# EAGLE design Voice Interaction Hat for raspberry pi v1.1 (EAGLE 6.1)
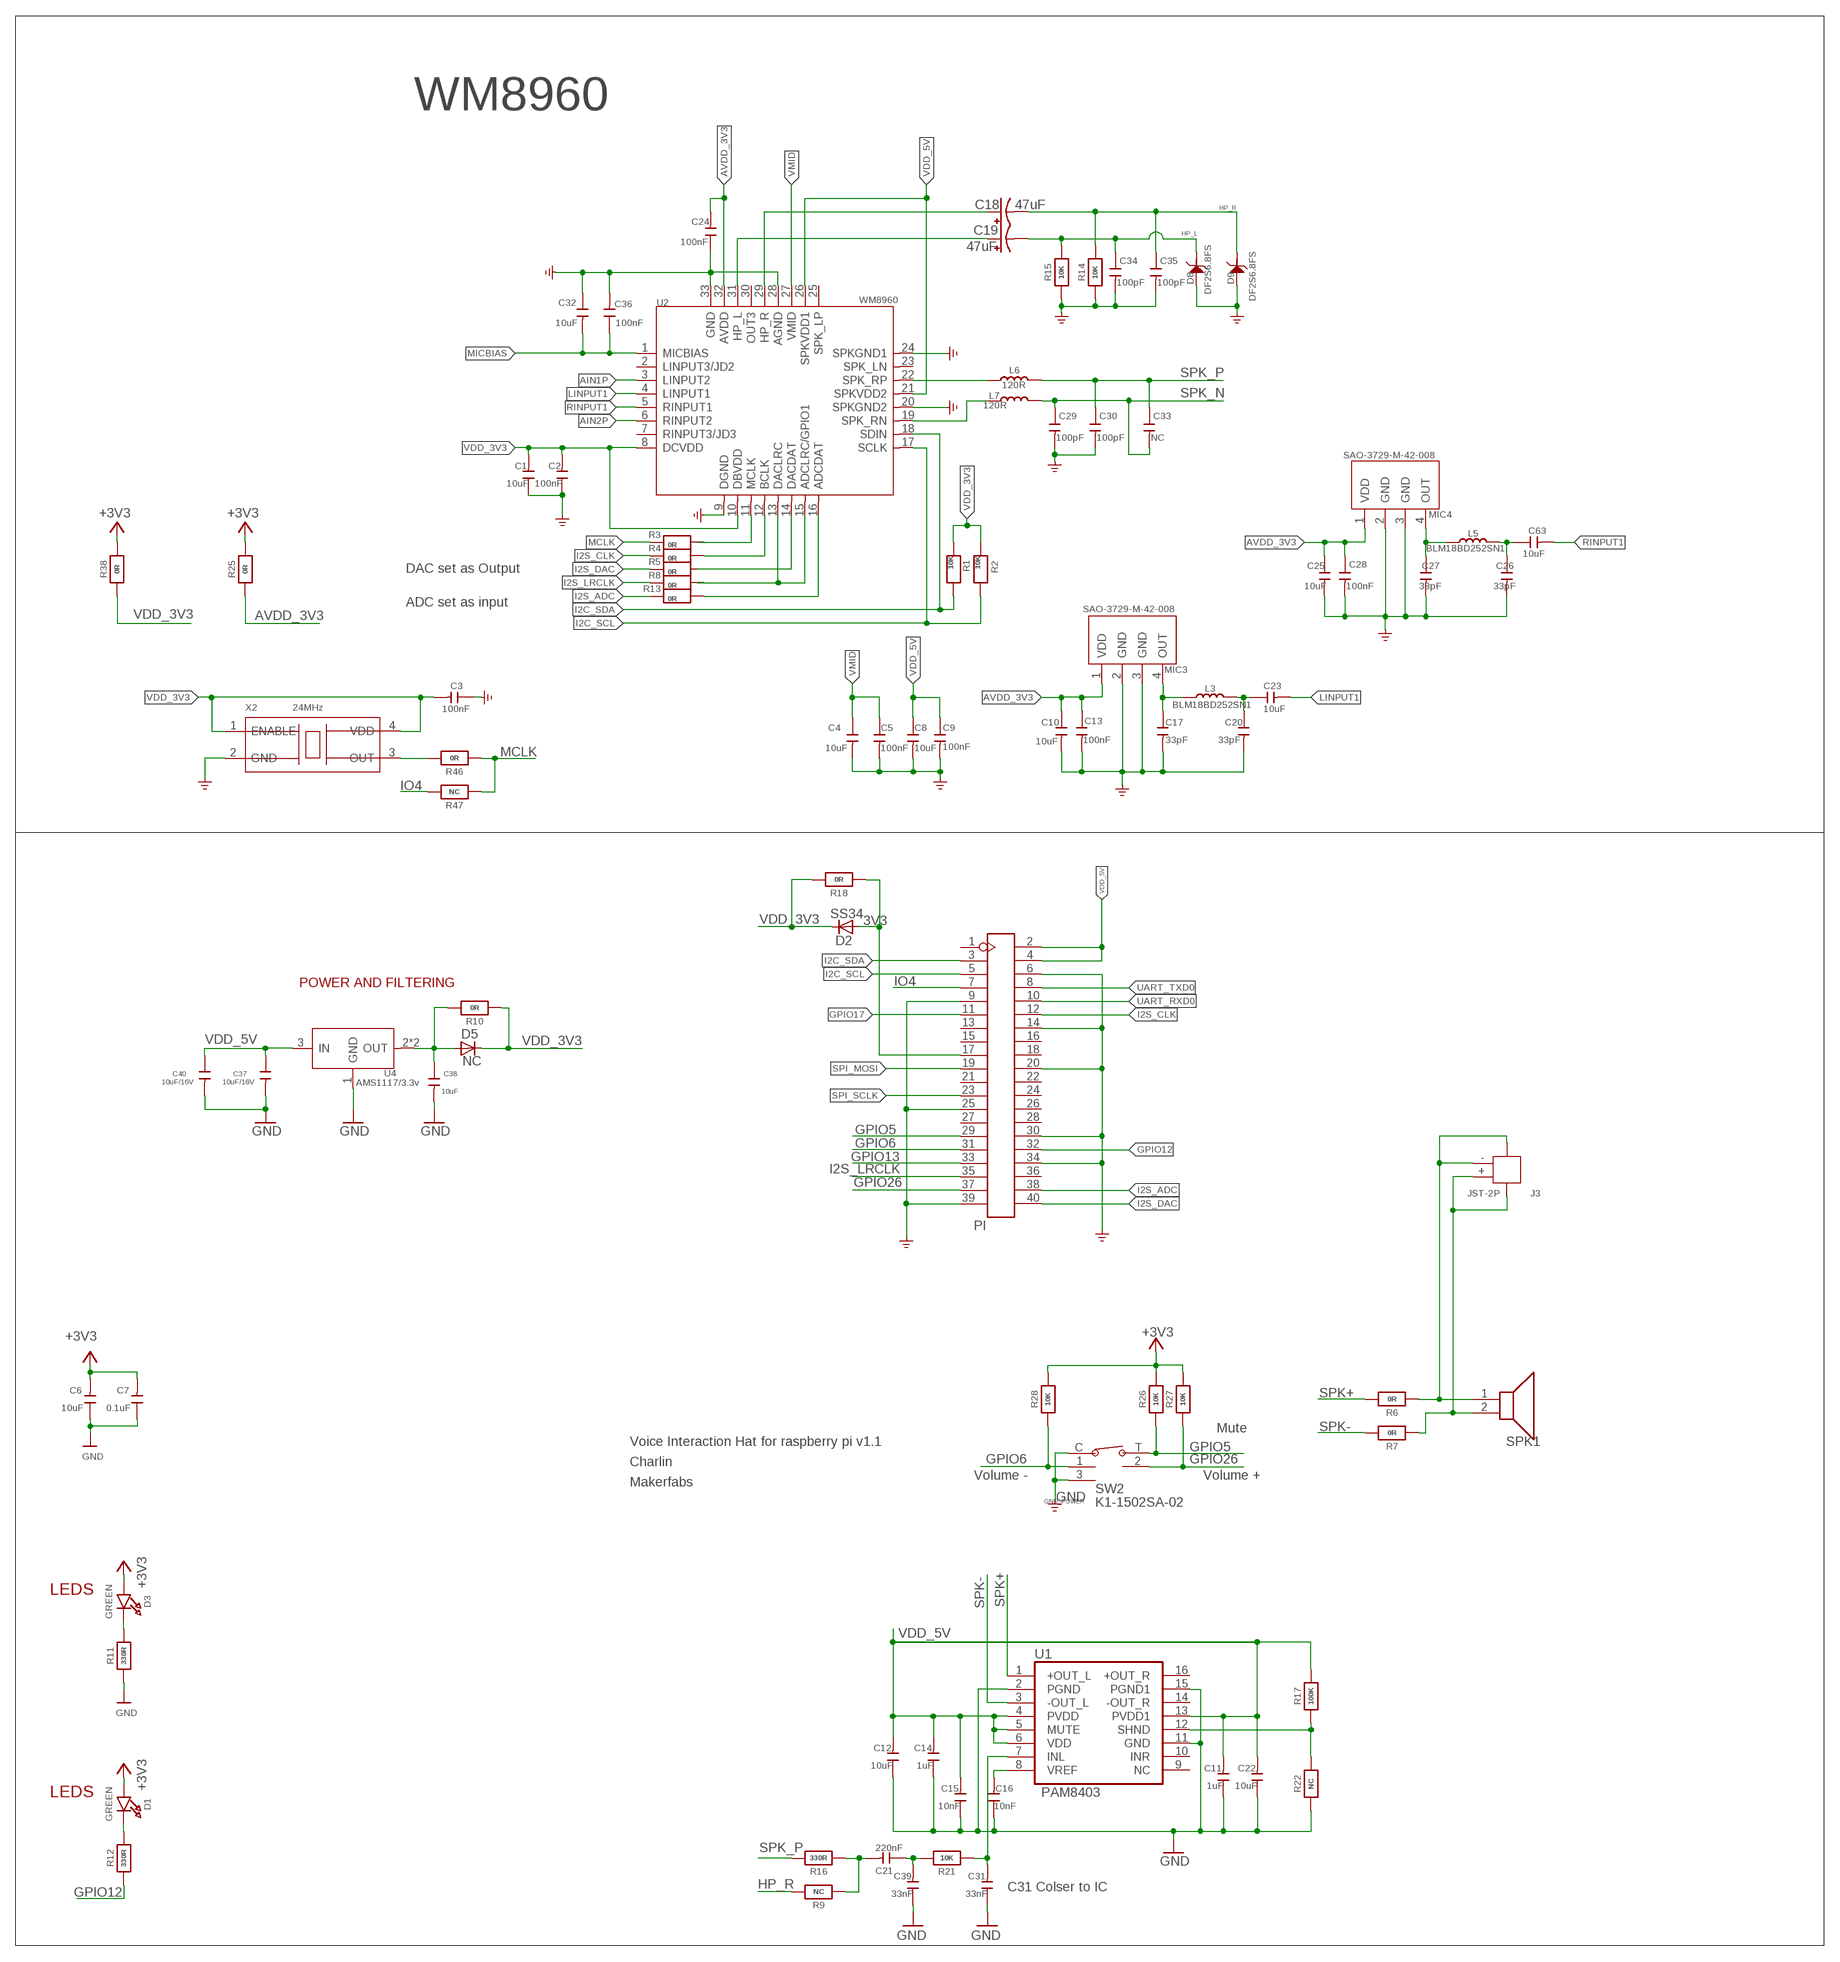
[diagram p0: schematic, sheet 1]

## Parts
C1  10uF  DISCRETE_C-0603  [DISCRETE_C0603]
C2  100nF  DISCRETE_C-0603  [DISCRETE_C0603]
C3  100nF  DISCRETE_C-0603  [DISCRETE_C0603]
C4  10uF  CAP-0603  [C0603]
C5  100nF  CAP-0603  [C0603]
C6  10uF  DISCRETE_C-0603  [DISCRETE_C0603]
C7  0.1uF  DISCRETE_C-0603  [DISCRETE_C0603]
C8  10uF  CAP-0603  [C0603]
C9  100nF  CAP-0603  [C0603]
C10  10uF  CAP-0603  [C0603]
C11  1uF  DISCRETE_C-0603  [DISCRETE_C0603]
C12  10uF  DISCRETE_C-0603  [DISCRETE_C0603]
C13  100nF  CAP-0603  [C0603]
C14  1uF  DISCRETE_C-0603  [DISCRETE_C0603]
C15  10nF  DISCRETE_C-0603  [DISCRETE_C0603]
C16  10nF  DISCRETE_C-0603  [DISCRETE_C0603]
C17  33pF  CAP-0603  [C0603]
C18  47uF  47UF-POLAR-EIA3528-10V-10%  [EIA3528]
C19  47uF  47UF-POLAR-EIA3528-10V-10%  [EIA3528]
C20  33pF  CAP-0603  [C0603]
C21  220nF  DISCRETE_C-0603  [DISCRETE_C0603]
C22  10uF  DISCRETE_C-0603  [DISCRETE_C0603]
C23  10uF  CAP-0603  [C0603]
C24  100nF  DISCRETE_C-0603  [DISCRETE_C0603]
C25  10uF  CAP-0603  [C0603]
C26  33pF  CAP-0603  [C0603]
C27  33pF  CAP-0603  [C0603]
C28  100nF  CAP-0603  [C0603]
C29  100pF  CAP-0603  [C0603]
C30  100pF  CAP-0603  [C0603]
C31  33nF  DISCRETE_C-0603  [DISCRETE_C0603]
C32  10uF  CAP-0603  [C0603]
C33  NC  CAP-0603  [C0603]
C34  100pF  CAP-0603  [C0603]
C35  100pF  CAP-0603  [C0603]
C36  100nF  DISCRETE_C-0603  [DISCRETE_C0603]
C37  10uF/16V  C-0603  [0603]
C38  10uF  C-0603  [0603]
C39  33nF  DISCRETE_C-0603  [DISCRETE_C0603]
C40  10uF/16V  C-0603  [0603]
C63  10uF  CAP-0603  [C0603]
D1  GREEN  LED0805_NOOUTLINE  [CHIPLED_0805_NOOUTLINE]
D2  SS34  DIODE-DO-214AC  [DO-214AC]
D3  GREEN  LED0805_NOOUTLINE  [CHIPLED_0805_NOOUTLINE]
D5  NC  DIODE-DO-214AC  [DO-214AC]
D8  DF2S6.8FS  D-ESD-2P'DF2S6.8FS'  [SOD-923]
D9  DF2S6.8FS  D-ESD-2P'DF2S6.8FS'  [SOD-923]
J3  JST-2P  JST-2P-SMD'2.0'  [HW2-SMD-2.0-90D]
L3  BLM18BD252SN1  INDUCTOR/FERRITE-BEAD'0603'  [L0603]
L5  BLM18BD252SN1  INDUCTOR/FERRITE-BEAD'0603'  [L0603]
L6  120R  INDUCTOR/FERRITE-BEAD'0603'  [L0603]
L7  120R  INDUCTOR/FERRITE-BEAD'0603'  [L0603]
MIC3  SAO-3729-M-42-008  MIC-MSM421A3729H8-C  [MIC4-SMD-3.76X2.95MM]
MIC4  SAO-3729-M-42-008  MIC-MSM421A3729H8-C  [MIC4-SMD-3.76X2.95MM]
PI  HEADER-2X20P1  [DIP-2X20-2.54MM]
R1  10K  RESISTOR_0603_NOOUT  [0603-NO]
R2  10K  RESISTOR_0603_NOOUT  [0603-NO]
R3  0R  RESISTOR_0603_NOOUT  [0603-NO]
R4  0R  RESISTOR_0603_NOOUT  [0603-NO]
R5  0R  RESISTOR_0603_NOOUT  [0603-NO]
R6  0R  RESISTOR_0603_NOOUT  [0603-NO]
R7  0R  RESISTOR_0603_NOOUT  [0603-NO]
R8  0R  RESISTOR_0603_NOOUT  [0603-NO]
R9  NC  RESISTOR_0603_NOOUT  [0603-NO]
R10  0R  RESISTOR_0603_NOOUT  [0603-NO]
R11  330R  RESISTOR_0603_NOOUT  [0603-NO]
R12  330R  RESISTOR_0603_NOOUT  [0603-NO]
R13  0R  RESISTOR_0603_NOOUT  [0603-NO]
R14  10K  RESISTOR_0603_NOOUT  [0603-NO]
R15  10K  RESISTOR_0603_NOOUT  [0603-NO]
R16  330R  RESISTOR_0603_NOOUT  [0603-NO]
R17  100K  RESISTOR_0603_NOOUT  [0603-NO]
R18  0R  RESISTOR_0603_NOOUT  [0603-NO]
R21  10K  RESISTOR_0603_NOOUT  [0603-NO]
R22  NC  RESISTOR_0603_NOOUT  [0603-NO]
R25  0R  RESISTOR_0603_NOOUT  [0603-NO]
R26  10K  RESISTOR_0603_NOOUT  [0603-NO]
R27  10K  RESISTOR_0603_NOOUT  [0603-NO]
R28  10K  RESISTOR_0603_NOOUT  [0603-NO]
R38  0R  RESISTOR_0603_NOOUT  [0603-NO]
R46  0R  RESISTOR_0603_NOOUT  [0603-NO]
R47  NC  RESISTOR_0603_NOOUT  [0603-NO]
SPK1  SPK  [SPK-SMD2-5000L3000W]
SW2  K1-1502SA-02  [SMD5-60P-1180L1170W]
U1  PAM8403  [SOP-16]
U2  WM8960  AMPLIFIER-WM8960  [QFN32G-0.5-5X5MM]
U4  AMS1117/3.3v  LD1117'SOT89'  [SOT89]
X2  24MHz  CRYSTAL-OSCILLATOR2.5*2.0  [OSC4-SMD-2.5X2.0X0.8MM]

## Nets
3V3: D2.A PI.17 R18.1
$123: C18.A(+) U2.29(HP_R)
$124: C19.A(+) U2.31(HP_L)
+3V3: C6.2 C7.2 D1.A D3.A R25.2 R26.2 R27.2 R28.2 R38.2
AIN1P: U2.3(LINPUT2)
AIN2P: U2.6(RINPUT2)
AUDIO_SHDN: R17.1 R22.2 U1.12(SHND)
AVDD_3V3: C10.1 C13.1 C24.2 C25.1 C28.1 MIC3.1(VDD) MIC4.1(VDD) R25.1 U2.32(AVDD)
GND: C1.1 C2.1 C3.1 C4.2 C5.2 C6.1 C7.1 C8.2 C9.2 C10.2 C11.1 C12.1 C13.2 C14.1 C15.1 C16.1 C17.2 C20.2 C22.1 C24.1 C25.2 C26.2 C27.2 C28.2 C29.2 C30.2 C31.1 C32.1 C34.2 C35.2 C36.2 C37.2 C38.2 C39.1 C40.2 D8.2 D9.2 MIC3.2(GND) MIC3.3(GND) MIC4.2(GND) MIC4.3(GND) PI.6 PI.9 PI.14 PI.20 PI.25 PI.30 PI.34 PI.39 R11.1 R14.1 R15.1 R22.1 SW2.3 SW2.C U1.2(PGND) U1.11(GND) U1.15(PGND1) U2.9(DGND) U2.20(SPKGND2) U2.24(SPKGND1) U2.28(AGND) U2.33(GND) U4.1(GND) X2.2(GND) ; supply symbol labelled GND_POWER
GPIO5: PI.29 R26.1 SW2.T
GPIO6: PI.31 R28.1 SW2.1
GPIO12: PI.32 R12.1
GPIO13: PI.33
GPIO17: PI.11
GPIO26: PI.37 R27.1 SW2.2
HP_L: C19.C(-) C34.1 D8.1 R15.2
HP_R: C18.C(-) C35.1 D9.1 R9.2 R14.2
I2C_SCL: PI.5 R2.1 U2.17(SCLK)
I2C_SDA: PI.3 R1.1 U2.18(SDIN)
I2S_ADC: PI.38 R13.2
I2S_CLK: PI.12 R4.2
I2S_DAC: PI.40 R5.2
I2S_LRCLK: PI.35 R8.2
IO4: PI.7 R47.2
LINPUT1: C23.2 U2.4(LINPUT1)
MCLK: R3.2 R46.1 R47.1
MICBIAS: C32.2 C36.1 U2.1(MICBIAS)
N$1: C38.1 D5.A R10.2 U4.2(OUT) U4.4(OUT)
N$3: D1.C R12.2
N$4: C31.2 R21.1 U1.7(INL)
N$5: D3.C R11.2
N$6: J3.3 J3.- R6.1 SPK1.1
N$7: C21.1 C39.2 R21.2
N$9: J3.4 J3.+ R7.1 SPK1.2
N$10: R5.1 U2.14(DACDAT)
N$12: C20.1 C23.1 L3.2
N$13: C17.1 L3.1 MIC3.4(OUT)
N$15: C26.1 C63.1 L5.2
N$16: C16.2 U1.8(VREF)
N$17: R46.2 X2.3(OUT)
N$30: C27.1 L5.1 MIC4.4(OUT)
N$34: R13.1 U2.16(ADCDAT)
N$35: R8.1 U2.13(DACLRC) U2.15(ADCLRC/GPIO1)
N$36: R4.1 U2.12(BCLK)
N$37: R3.1 U2.11(MCLK)
N$42: L6.1 U2.22(SPK_RP)
N$45: L7.1 U2.19(SPK_RN)
N$62: C21.2 R9.1 R16.1
RINPUT1: C63.2 U2.5(RINPUT1)
SPI_MOSI: PI.19
SPI_SCLK: PI.23
SPK+ [3V3]: R6.2 U1.1(+OUT_L)
SPK- [3V3]: R7.2 U1.3(-OUT_L)
SPK_N: C29.1 C33.2 L7.2
SPK_P: C30.1 C33.1 L6.2 R16.2
UART_RXD0: PI.10
UART_TXD0: PI.8
VDD_3V3: C1.2 C2.2 C3.2 D2.C D5.C R1.2 R2.2 R10.1 R18.2 R38.1 U2.8(DCVDD) U2.10(DBVDD) X2.1(ENABLE) X2.4(VDD)
VDD_5V: C8.1 C9.1 C11.2 C12.2 C14.2 C15.2 C22.2 C37.1 C40.1 PI.2 PI.4 R17.2 U1.4(PVDD) U1.5(MUTE) U1.6(VDD) U1.13(PVDD1) U2.21(SPKVDD2) U2.26(SPKVDD1) U4.3(IN)
VMID: C4.1 C5.1 U2.27(VMID)
Unconnected: PI.1 PI.13 PI.15 PI.16 PI.18 PI.21 PI.22 PI.24 PI.26 PI.27 PI.28 PI.36 U1.9(NC) U1.10(INR) U1.14(-OUT_R) U1.16(+OUT_R) U2.2(LINPUT3/JD2) U2.7(RINPUT3/JD3) U2.23(SPK_LN) U2.25(SPK_LP) U2.30(OUT3)

## Notes on the sheet
- WM8960
- DAC set as Output
- ADC set as input
- POWER AND FILTERING
- Mute
- Voice Interaction Hat for raspberry pi v1.1
- Charlin
- Volume - | Volume +
- Makerfabs
- LEDS
- LEDS
- C31 Colser to IC

## Library data of the parts
C1-C3 C6 C7 C11 C12 C14-C16 C21 C22 C24 C31 C36 C39 = A9G:DISCRETE_C*: Ceramic Capacitors
C4 C5 C8-C10 C13 C17 C20 C23 C25-C30 C32-C35 C63 = Discrete-new:CAP: Ceramic Capacitors
C18 C19 = SparkFun-Capacitors:47UF-POLAR: 47µF polarized capacitors A capacitor is a passive two-terminal electrical component used to store electrical energy temporarily in an electric field.; PROD_ID: CAP-08310
C37 C38 C40 = Discrete:C*: Ceramic Capacitors
D1 D3 = microbuilder:LED: LED 0603 - 0603 Surface Mount Package 2mA: Green LED - Low Power (3.9mcd, 2ma, 1.7Vf) - Digikey: 475-2709-2-ND Orange LED - Low Power (9.8mcd, 2ma, 1.8Vf) - Digikey: 475-1194-2-ND Red LED - Low Power (5mcd, 2ma, 1.8Vf) - Digikey: 475-1195-2-ND Yellow LED - Low Power (7mcd, 2ma, 1.8Vf) - Digikey: 475-1196-2-ND 5mA: Blue LED - Low Power (17mcd, 5ma, 2.9Vf) - Digikey: LNJ937W8CRACT-ND 0805 - 0805 Surface Mount Package 2mA: Red LED (8.8mcd, 2mA, 1.8Vf, Clear) - Low Power [Digikey: 475-2510-1-ND] Green LED (5mcd, 2mA, 1.8Vf, Clear) - Low Power [Digikey: 475-2730-1-ND] Yellow LED (11.3mcd, 2mA, 1.8Vf, Clear) - Low Power [Digikey: 475-2555-1-ND] 20mA: Red LED (104mcd, 20mA, Diffused) - LS R976 [Digikey: 475-1278-6-ND] Red LED (12mcd, 20mA, 2.0Vf, Clear) - APT2012EC [Digikey: 754-1128-1-ND] Green LED (15mcd, 20mA, 2.2Vf, Clear) - APT2012GC [Digikey: 754-1131-1-ND] Orange LED (160mcd, 20mA, 2.1Vf, Clear) - APT2012SECK [Digikey: 754-1130-1-ND] 1206 - 1206 Surface Mount Package Green LED (26mcd, 20mA, Diffused) - LG N971 [Digikey: 475-1407-6-ND] Red LED (15mcd, 20mA, Diffused) - LH N974 [Digikey: 475-1416-6-ND] Cree - Cree High-Power Surface Mount LEDs XPEBWT-L1-0000-00D50 - White 111lm 350mA 2.9Vf 6200K 110° XTEAWT-00-0000-00000LEE3 - White 114lm 350mA 2.85Vf 5000K 115° Everlight - Everlight 45-21 Series Surface Mount LEDs 45-21/QK2C-B2832AC2CB2/2T - Warm White 2000mcd 20mA 3.25Vf 3050K 120° 45-21/LK2C-B38452C4CB2/2T - Nuetral White 2000mcd 20mA 3.25Vf 4150K 120° 45-21/LK2C-B50634C6CB2/2T - Cold White 2200mcd 20mA 3.25Vf 5650K 120° PLCC2 Reverse Mount LS T77K-J1L2-1-0-2-R18-Z - Red 11.25mcd 2mA 1.8Vf 630nm 120° LO T77K-L1M2-24-Z - Orange 19.6mcd 2mA 1.8Vf 606nm 120° LY T77K-K2M1-26-Z - Yellow 15.7mcd 2mA 1.8Vf 587nm 120°
D2 D5 = diode:DIODE-: DIODE
D8 D9 = Discrete-new:D-ESD-2P: SOD-923:304060009;SOD-123:304060001
J3 = Connector-new:JST-2P-SMD: 2P-SMD-1.0-90D:320110054;2P-SMD-2.0-90D:320110026
L3 L5-L7 = Discrete-new:INDUCTOR/FERRITE-BEAD
MIC3 MIC4 = Connector-new:MIC-MSM421A3729H8-C
PI = self:HEADER-2X20P
R1-R18 R21 R22 R25-R28 R38 R46 R47 = microbuilder:RESISTOR: Resistors For new designs, use the packages preceded by an '_' character since they are more reliable: The following footprints should be used on most boards: _0402 - Standard footprint for regular board layouts _0603 - Standard footprint for regular board layouts _0805 - Standard footprint for regular board layouts _1206 - Standard footprint for regular board layouts For extremely tight-pitch boards where space is at a premium, the following 'micro-pitch' footprints can be used (smaller pads, no silkscreen outline, etc.): _0402MP - Micro-pitch footprint for very dense/compact boards _0603MP - Micro-pitch footprint for very dense/compact boards _0805MP - Micro-pitch footprint for very dense/compact boards _1206MP - Micro-pitch footprint for very dense/compact boards
SPK1 = self:SPK
SW2 = self:K1-1502SA-02
U1 = PAM8403:PAM8403: Dual channel audio amplifier IC - PAM8403
U2 = IC-new:AMPLIFIER-WM8960
U4 = IC:LD1117: Low Drop Fixed And Adjustable Positive Voltage Regulators http://www.datasheetcatalog.org/datasheet/SGSThomsonMicroelectronics/mXuqtqv.pdf
X2 = Discrete-new:CRYSTAL-OSCILLATOR

## Net classes
0 default: width 0.203 mm, drill 0.305 mm, clearance 0.152 mm
2 3V3: width 0.305 mm
3 usbvcc: width 0.508 mm, drill 0.61 mm, clearance 0.254 mm

## Board
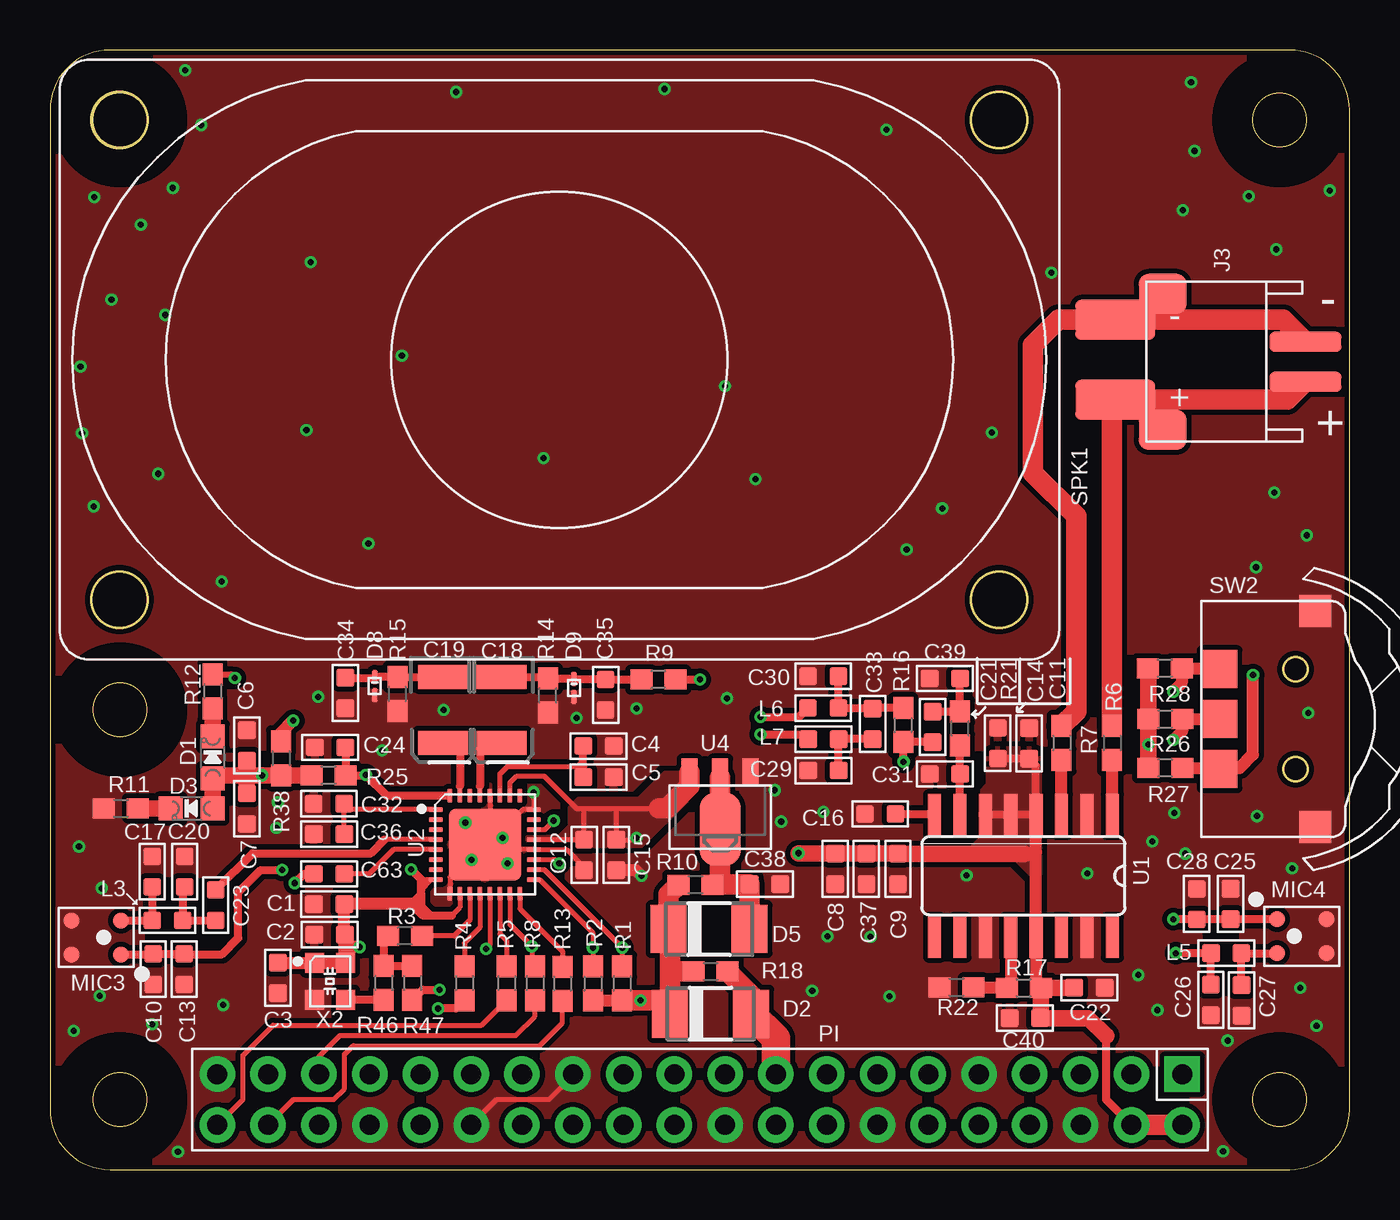
[diagram p1: board, top side]
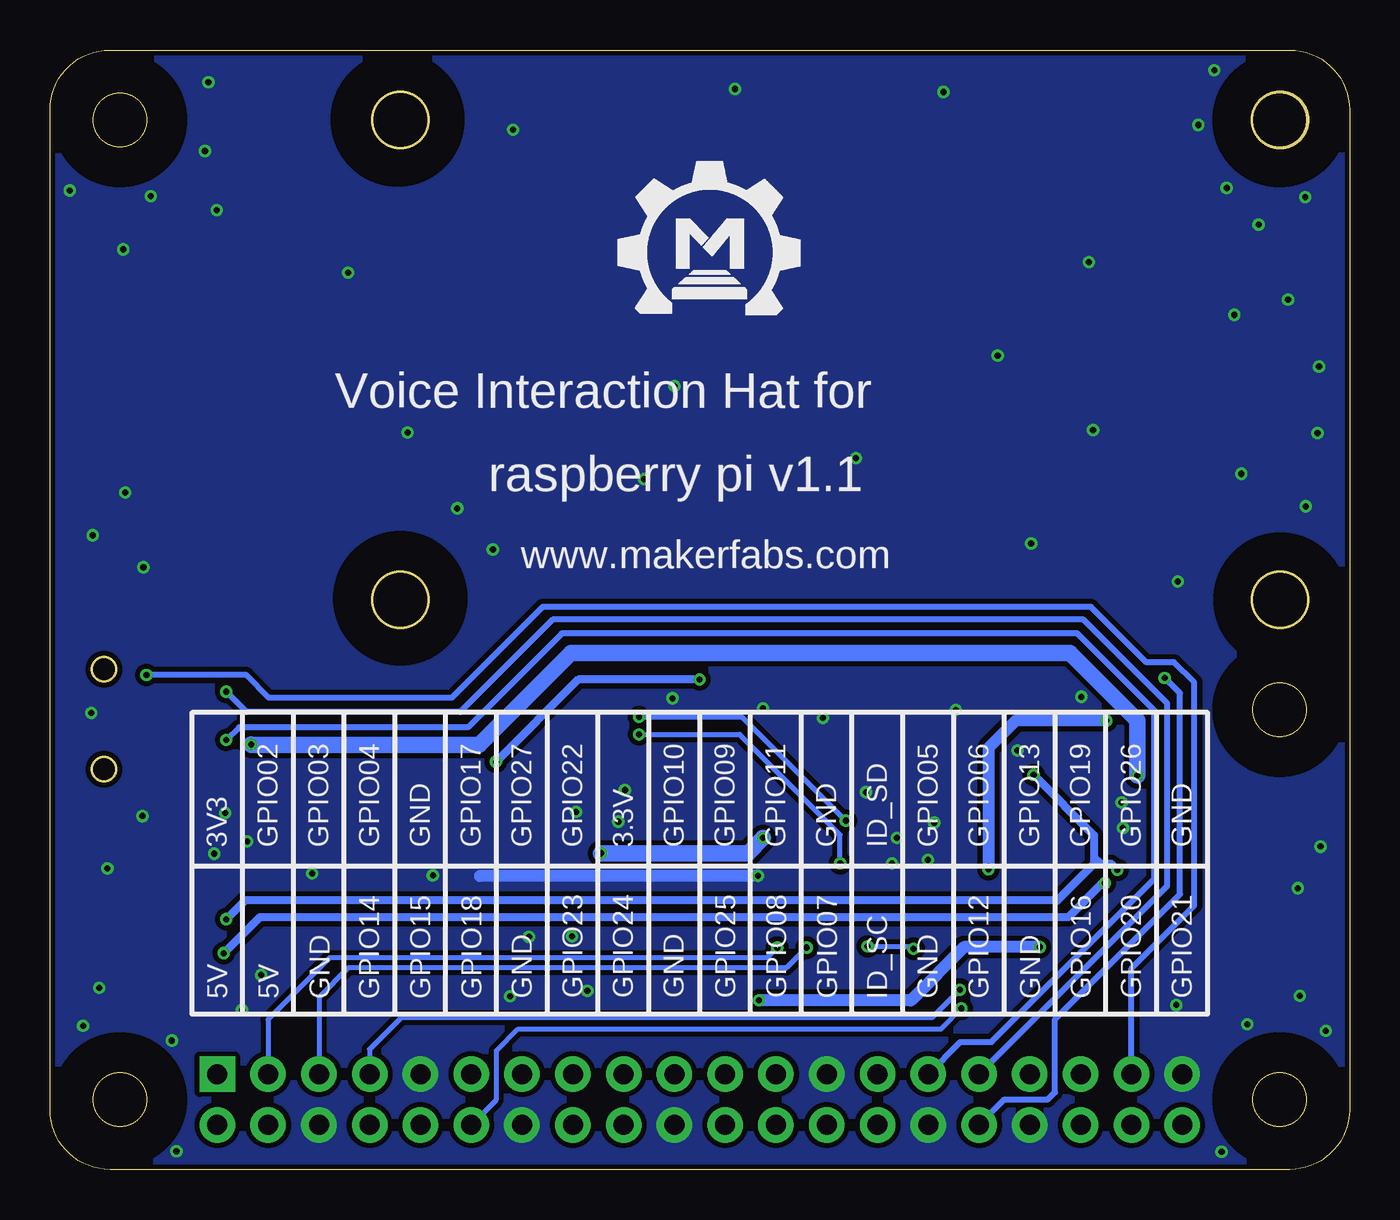
[diagram p2: board, bottom side, seen from below]

Size 65 x 56 mm. Coordinates in mm from the lower left corner, seen from the top.
Outline: 0,53 0,3 arc90 3,0 62,0 arc90 65,3 65,53 arc90 62,56 3,56 arc90 0,53
Outline: circle at 61.5,3.5 radius 1.35
Outline: circle at 61.5,52.5 radius 1.35
Outline: circle at 3.5,3.5 radius 1.35
Outline: circle at 3.5,52.5 radius 1.35
Outline: circle at 3.5,23 radius 1.35
Copper layers (1*16): Top 0.035mm / dielectric 1.5mm / Bottom 0.035mm
Design rules: minimum track width 6mil, minimum drill 10mil, track to track 6mil, track to pad 6mil, pad to pad 6mil, via to via 6mil, smd to smd 0mil, copper to edge 10mil, drill to drill 10mil, minimum pad ring 10mil, minimum via ring 6mil, stop-mask expansion 2mil, vias tented up to drill 100mil, thermal gap 0mil
tRestrict: area 0.5,0.5 to 6.5,6.5; area 58.5,0.5 to 64.5,6.5; area 58.5,49.5 to 64.5,55.5; area 0.5,49.5 to 6.5,55.5; area 0.5,20 to 6.5,26
bRestrict: area 58.5,49.5 to 64.5,55.5; area 0.5,49.5 to 6.5,55.5; area 58.5,0.5 to 64.5,6.5; area 0.5,0.5 to 6.5,6.5; area 0.5,20 to 6.5,26; area 44.5,25.6 to 50.5,31.6; area 44.6,49.5 to 50.6,55.5; area 0.5,25.5 to 6.5,31.5

### Footprints (pad centres in the part's own frame; a part is rotated, then mirrored left to right if it is on the bottom)
DISCRETE_C0603 = smd 0.889 x 0.889: 1 -0.762,0; 2 0.762,0
C0603 = smd 0.889 x 0.889: 1 0,0.762; 2 0,-0.762
EIA3528 = smd 1.2 x 2.5: A 1.65,0; C -1.65,0
0603 = smd 0.889 x 0.889: 1 -0.762,0; 2 0.762,0
CHIPLED_0805_NOOUTLINE = smd 1.2 x 1.2: A 0,-1.05; C 0,1.05
DO-214AC = smd 1.8 x 2.4: A 2.025,0; C -2.025,0
SOD-923 = smd 0.7 x 0.3: 1 -0.45,0; 2 0.45,0
HW2-SMD-2.0-90D = smd 2 x 2.4: 3 3.4,-2.181; 4 -3.4,-2.181 | smd 1 x 3.6: + -1,4.953; - 1,4.953
L0603 = smd 0.889 x 0.889: 1 -0.762,0; 2 0.762,0
MIC4-SMD-3.76X2.95MM = smd 0.8 x 0.8: 1 0.85,1.23; 2 0.85,-1.23; 3 -0.85,-1.23; 4 -0.85,1.23
DIP-2X20-2.54MM = drill 1 pad 1.778 square: 1 24.13,1.27 | drill 1 pad 1.778: 2 24.13,-1.27; 3 21.59,1.27; 4 21.59,-1.27; 5 19.05,1.27; 6 19.05,-1.27; 7 16.51,1.27; 8 16.51,-1.27; 9 13.97,1.27; 10 13.97,-1.27; 11 11.43,1.27; 12 11.43,-1.27; 13 8.89,1.27; 14 8.89,-1.27; 15 6.35,1.27; 16 6.35,-1.27; 17 3.81,1.27; 18 3.81,-1.27; 19 1.27,1.27; 20 1.27,-1.27; 21 -1.27,1.27; 22 -1.27,-1.27; 23 -3.81,1.27; 24 -3.81,-1.27; 25 -6.35,1.27; 26 -6.35,-1.27; 27 -8.89,1.27; 28 -8.89,-1.27; 29 -11.43,1.27; 30 -11.43,-1.27; 31 -13.97,1.27; 32 -13.97,-1.27; 33 -16.51,1.27; 34 -16.51,-1.27; 35 -19.05,1.27; 36 -19.05,-1.27; 37 -21.59,1.27; 38 -21.59,-1.27; 39 -24.13,1.27; 40 -24.13,-1.27
0603-NO = smd 1.1 x 1: 1 -0.85,0; 2 0.85,0
SPK-SMD2-5000L3000W = smd 4 x 2: 1 27.8,-2; 2 27.8,2
SMD5-60P-1180L1170W = smd 1.9 x 1.8: 1 -2.5,0; 2 2.5,0; T 0,0 | smd 1.6 x 1.6: 3 -5.4,4.8; C 5.4,4.8
SOP-16 = smd 0.66 x 2.032: 1 -4.445,-3.073; 2 -3.175,-3.073; 3 -1.905,-3.073; 4 -0.635,-3.073; 5 0.635,-3.073; 6 1.905,-3.073; 7 3.175,-3.073; 8 4.445,-3.073; 9 4.445,3.073; 10 3.175,3.073; 11 1.905,3.073; 12 0.635,3.073; 13 -0.635,3.073; 14 -1.905,3.073; 15 -3.175,3.073; 16 -4.445,3.073
QFN32G-0.5-5X5MM = smd 0.7 x 0.25: 1 -2.45,1.75; 2 -2.45,1.25; 3 -2.45,0.75; 4 -2.45,0.25; 5 -2.45,-0.25; 6 -2.45,-0.75; 7 -2.45,-1.25; 8 -2.45,-1.75; 17 2.45,-1.75; 18 2.45,-1.25; 19 2.45,-0.75; 20 2.45,-0.25; 21 2.45,0.25; 22 2.45,0.75; 23 2.45,1.25; 24 2.45,1.75 | smd 0.25 x 0.7: 9 -1.75,-2.45; 10 -1.25,-2.45; 11 -0.75,-2.45; 12 -0.25,-2.45; 13 0.25,-2.45; 14 0.75,-2.45; 15 1.25,-2.45; 16 1.75,-2.45; 25 1.75,2.45; 26 1.25,2.45; 27 0.75,2.45; 28 0.25,2.45; 29 -0.25,2.45; 30 -0.75,2.45; 31 -1.25,2.45; 32 -1.75,2.45 | smd 3.6 x 3.6: 33 0,0
SOT89 = smd 0.8 x 1.4: 1 -1.524,-1.905; 3 1.524,-1.905 | smd 0.8 x 1.9: 2 0,-1.651 | smd 2.032 x 3.65: 4 0,0.94
OSC4-SMD-2.5X2.0X0.8MM = smd 1 x 0.95: 1 -0.925,-0.775; 2 0.925,-0.775; 3 0.925,0.775; 4 -0.925,0.775

### Placement (x,y rotation side)
C1  13.96,13.28 0 top
C2  13.98,11.74 0 top
C3  11.4,9.58 90 top
C4  27.44,21.18 90 top
C5  27.44,19.63 90 top
C6  9.85,21.22 270 top
C7  9.85,18.05 90 top
C8  39.28,15.04 0 top
C9  42.41,15.04 0 top
C10  5.16,10.02 0 top
C11  48.98,21.31 270 top
C12  26.72,15.74 90 top
C13  6.71,10.02 0 top
C14  47.41,21.32 270 top
C15  28.33,15.74 90 top
C16  41.53,17.79 0 top
C17  5.11,14.9 180 top
C18  22.59,23 270 top
C19  19.66,23 270 top
C20  6.74,14.9 180 top
C21  44.16,22.14 270 top
C22  51.99,9.1 180 top
C23  8.29,13.22 180 top
C24  14.02,21.11 0 top
C25  59.05,13.28 180 top
C26  58.06,8.48 0 top
C27  59.59,8.47 0 top
C28  57.36,13.28 180 top
C29  38.69,19.96 270 top
C30  38.68,24.67 270 top
C31  44.75,19.79 0 top
C32  13.95,18.31 90 top
C33  41.14,22.29 0 top
C34  14.77,23.83 0 top
C35  27.79,23.75 0 top
C36  13.96,16.78 180 top
C37  40.83,15.04 270 top
C38  35.76,14.27 0 top
C39  44.75,24.56 0 top
C40  48.77,7.57 180 top
C63  13.96,14.79 90 top
D1  8.14,20.62 0 top
D2  33.05,7.8 0 top
D3  7.08,18.06 90 top
D5  32.97,12.03 0 top
D8  16.25,24.18 270 top
D9  26.21,24.09 270 top
J3  57.84,40.41 270 top
L3  5.87,12.46 0 top
L5  58.83,10.82 180 top
L6  38.68,23.08 0 top
L7  38.68,21.52 0 top
MIC3  2.31,11.61 270 top
MIC4  62.61,11.67 90 top
PI  32.5,3.5 0 top
R1  28.61,9.31 270 top
R2  27.15,9.31 270 top
R3  17.75,11.68 180 top
R4  20.73,9.32 270 top
R5  22.83,9.32 270 top
R6  53.12,21.34 270 top
R7  50.6,21.33 270 top
R8  24.26,9.32 270 top
R9  30.43,24.51 180 top
R10  32.28,14.25 0 top
R11  3.55,18.07 0 top
R12  8.14,23.92 270 top
R13  25.63,9.3 270 top
R14  24.91,23.71 90 top
R15  17.39,23.79 90 top
R16  42.68,22.23 90 top
R17  48.7,9.09 0 top
R18  33.05,9.91 180 top
R21  45.52,22.07 90 top
R22  45.34,9.11 0 top
R25  13.93,19.72 180 top
R26  55.78,22.53 180 top
R27  55.78,20.08 180 top
R28  55.76,25.07 180 top
R38  11.55,20.57 270 top
R46  16.68,9.33 270 top
R47  18.12,9.33 270 top
SPK1  25.48,40.51 0 top
SW2  58.49,22.53 270 top
U1  48.69,14.69 180 top
U2  21.76,16.26 0 top
U4  33.52,17.95 180 top
U$1  [MAKERFABS_0.3]  36.12,42.8 0 bottom
X2  14,9.42 270 top

### Tracks (layer width: path | path; a pad name or v marks a point on that pad's centre or on a via)
3V3
  Top 1.016: R18.1 35.07,8.73 D2.A
  Top 1.422: PI.17 36.31,6.56 D2.A
$123
  Top 0.254: U2.29 21.51,19.18 21.51,20.27
  Top 0.406: C18.A 22.5,21.44 21.89,21.44 21.51,21.05 21.51,19.18
$124
  Top 0.254: U2.31 20.51,19.18
  Top 0.406: 20.51,19.18 20.51,20.99 20.24,21.26 19.75,21.26 C19.A
+3V3  (via drill 0.3)
  Top 0.813: R25.2 R38.2 v10.62,19.72 9.65,19.72 | 9.65,19.72 8.29,19.72 D1.A 8.13,19.56 D3.A | C7.2 9.85,19.53 9.65,19.72 | C6.2 9.85,19.92 9.65,19.72 | R27.2 54.93,21.25 v54.94,21.26 v54.93,21.27 R26.2 54.93,25.05 R28.2
  Bottom 0.813: v10.62,19.72 10.62,22.45 13.99,25.83 38.94,25.83 43.54,21.23 54.91,21.23 v54.94,21.26
AUDIO_SHDN
  Top 0.61: U1.12 48.05,9.29 R17.1 47.83,9.11 R22.2
AVDD_3V3  (via drill 0.3)
  Top 0.254: U2.32 19.86,18.71 | 6.16,10.77 6.15,10.78
  Top 0.406: MIC3.1 5.16,10.76 C10.1 6.15,10.78 C13.1 | MIC4.1 C25.1 C28.1 56.99,12.52 v56.19,12.52 | C24.2 R25.1 15.79,19.72 v15.8,19.74 16.83,18.71 19.86,18.71 | 6.16,10.77 8.61,10.77 9.42,11.58 9.42,13.87 10.54,14.99 v11.61,14.99
  Bottom 0.406: 12.78,15.29 14.61,13.46 55.24,13.46 v56.19,12.52 | v15.8,19.74 12.78,16.71 12.78,15.62 | 12.78,15.62 12.78,15.29 | v11.61,14.99 11.91,15.29 12.45,15.29 | 12.45,15.29 12.78,15.29 | 12.45,15.29 12.78,15.62
GND  (via drill 0.3)
  Top 0.254: v24.18,18.87 24.18,18.04 U2.24 23.64,18.01 22.66,17.02 | 22.01,16.01 21.39,16.01 20.01,14.63 U2.9 | PI.30 22.34,3.5 24.97,3.5 26.15,4.69 PI.25 | U2.28 22.01,16.51 U2.33 22.01,16.01 | C12.1 26.72,15.12 25.83,16.01 U2.20 22.01,16.01 | C15.1
  Top 0.61: 22.01,16.51 22.52,17.02 22.66,17.02 | C15.1 29.3,14.98 v29.59,14.68
  Bottom 0.61: v29.59,14.68 43.51,14.68
  other vias: 45.85,14.71 38.13,8.94 58.67,0.91 63.35,7.19 62.53,9.09 54.43,9.73 60.38,17.68 56.24,17.83 51.89,14.81 56.79,15.8 29.34,23.06 44.63,33.07 20.78,17.35 22.63,16.59 21.08,15.49 22.89,15.32 36.58,17.4 41.99,8.66 38.89,11.66 41.05,11.63 1.19,6.93 5.11,7.26 6.4,0.89 2.49,8.69 8.66,8.23 1.45,16.15 2.59,14.07 11.4,18.36 11.33,17.09 16.61,20.95 19.68,22.99 8.59,29.41 13.41,23.65 5.41,34.8 2.18,33.17 15.93,31.32 17.6,40.72 3.07,43.51 4.55,47.27 2.21,48.64 6.76,54.99 7.57,52.25 6.15,49.1 1.6,36.83 1.52,40.16 5.77,42.75 64.01,48.97 59.97,48.69 57.07,54.38 57.25,50.95 61.34,46.02 56.67,47.98 62.87,31.72 61.24,33.86 62.94,22.83 60.33,30.12 24.69,35.59 35.28,34.54 58.9,6.45 55.14,16.41 55.4,7.98 62.13,15.06 38.68,17.88 33.86,23.57 42.85,31.01 33.76,39.19 26.34,22.58 36.25,18.97 12.83,36.98 13.03,45.39 47.12,36.86 50.09,44.86 20.32,53.9 30.73,54.05 41.83,52.02
  pour Bottom (isolate 0.254, rank 6): -7.62,63.5 76.2,63.5 76.2,-5.08 -7.62,-5.08
  pour Top (isolate 0.254, rank 6): -7.62,63.5 76.2,63.5 76.2,-5.08 -7.62,-5.08
GPIO5  (via drill 0.3)
  Top 0.61: SW2.T R26.1 56.63,21.93 v56.19,21.49
  Bottom 0.305: PI.29 19.46,6.38 17.91,6.38 9.75,14.53 9.75,22.96 13.61,26.82 39.4,26.82 44.09,22.12 55.55,22.12 v56.19,21.49
GPIO6  (via drill 0.3)
  Top 0.61: SW2.1 58.45,25.07 R28.1 56.61,24.33 v56.19,23.9
  Bottom 0.305: PI.31 9.12,14.18 9.12,23.32 13.31,27.51 39.85,27.51 44.48,22.89 55.17,22.89 v56.19,23.9
GPIO12  (via drill 0.3)
  Top 0.305: R12.1 9.06,24.77 v9.25,24.59
  Bottom 0.305: PI.32 17.25,3.5 15.09,3.5 14.73,3.86 14.73,7.52 8.48,13.77 8.48,23.82 v9.25,24.59
GPIO26  (via drill 0.3)
  Top 0.61: R27.1 58.44,20.08 | 58.44,20.08 SW2.2 | 58.44,20.08 59.5,20.08 60.17,20.75 v60.17,24.74
  Bottom 0.305: PI.37 10.91,10.07 7.77,13.21 7.77,24.38 8.76,25.38 10.16,25.38 12.93,28.14 40.36,28.14 44.91,23.6 54.05,23.6 55.19,24.74 v60.17,24.74
HP_L
  Top 0.406: C34.1 16.21,24.59 D8.1 R15.2 C19.C
HP_R
  Top 0.406: C18.C 24.82,24.65 R14.2 26.19,24.56 D9.1 27.76,24.54 C35.1 R9.2
I2C_SCL  (via drill 0.3)
  Top 0.254: R2.1 v27.15,11.1 27.15,11.84 24.48,14.51 U2.17
  Bottom 0.254: v27.15,11.1 28.17,10.08 50.09,10.08 51.55,8.62 PI.5
I2C_SDA  (via drill 0.3)  (1 unrouted)
  Top 0.254: U2.18 24.72,15.01 28.61,11.11 R1.1
  Bottom 0.254: v28.63,11.1 29.13,10.59 51,10.59 54.09,7.5 PI.3
I2S_ADC
  Top 0.254: PI.38 12.19,3.5 14.2,3.5 14.73,4.04 14.73,5.77 15.16,6.2 24.49,6.2 25.63,7.34 R13.2
I2S_CLK  (via drill 0.3)
  Top 0.406: R4.2 20.31,8.05 v19.41,8.05
  Bottom 0.254: PI.12 42.67,3.49 42.67,5.94 41.58,7.04 20.42,7.04 v19.41,8.05
I2S_DAC
  Top 0.254: PI.40 9.65,3.51 9.65,5.71 11.15,7.21 21.58,7.21 R5.2
I2S_LRCLK
  Top 0.254: PI.35 13.45,5.65 14.5,6.71 23.29,6.71 24.26,7.67 R8.2
IO4  (via drill 0.3)
  Top 0.406: R47.2 18.63,8.99 v19.48,8.99
  Bottom 0.254: v19.48,8.99 20.88,7.59 47.45,7.59 49.02,6.02 49.02,4.78 PI.7
LINPUT1
  Top 0.254: U2.4 16.73,16.51
  Top 0.406: 16.73,16.51 16.05,15.82 10.13,15.82 C23.2
MCLK
  Top 0.406: R3.2 16.68,11.46 R46.1 R47.1
MICBIAS
  Top 0.254: U2.1 15.02,18.01 C32.2 C36.1
N$1
  Top 1.016: D5.A C38.1 33.78,14.27 | R10.2 33.15,14.27 33.78,14.27 | 33.78,14.27 33.52,14.53 U4.4 U4.2
N$3
  Top 0.813: D1.C R12.2
N$4
  Top 0.406: U1.7 C31.2 R21.1
N$5
  Top 0.813: D3.C 4.41,18.06 R11.2
N$6
  Top 1.016: R6.1 53.12,38.35 SPK1.1 55.37,38.51 | 55.37,38.51 61.89,38.51 J3.- | J3.3 55.66,38.23 55.37,38.51
N$7
  Top 0.406: C21.1 45.51,22.9 R21.2 C39.2
N$9
  Top 1.016: R7.1 51.33,22.92 51.33,32.69 49.17,34.85 49.17,41.25 50.43,42.51 SPK1.2 55.47,42.51 | 55.47,42.51 61.69,42.51 J3.+ | J3.4 55.66,42.69 55.47,42.51
N$10
  Top 0.254: U2.14 22.51,11.78 22.84,11.46 R5.1
N$12
  Top 0.406: C23.1 L3.2 6.64,14.14 C20.1
N$13
  Top 0.406: MIC3.4 L3.1 C17.1
N$15  (via drill 0.3)
  Top 0.254: v56.31,10.82 v56.32,10.82
  Top 0.406: C26.1 L5.2 v56.31,10.82 | C63.1 12.7,14.79 v12.24,14.33
  Bottom 0.406: v12.24,14.33 12.37,14.33 14.07,12.62 54.51,12.62 v56.31,10.82
N$16
  Top 0.406: U1.8 42.31,17.76 C16.2
N$17
  Top 0.406: R46.2 16.67,8.49 X2.3
N$30
  Top 0.406: C27.1 L5.1 MIC4.4
N$34
  Top 0.254: U2.16 23.51,13.04 25.63,10.92 R13.1
N$35  (via drill 0.3)
  Top 0.254: U2.13 22.01,11.25 v21.81,11.04 | U2.15 23.01,12.26 v24.1,11.16 24.1,10.33 R8.1
  Bottom 0.254: v24.1,11.16 21.93,11.16 v21.81,11.04
N$36
  Top 0.254: U2.12 21.51,12.11 20.73,11.33 R4.1
N$37
  Top 0.254: U2.11 21.01,12.48 20.22,11.68 R3.1
N$42  (via drill 0.3)
  Top 0.254: U2.22 24.75,17.01 v25.2,17.45
  Top 0.406: v35.53,22.63 37.46,22.63 L6.1
  Bottom 0.254: v35.53,22.63 30.38,22.63 v25.2,17.45
N$45  (via drill 0.3)
  Top 0.254: U2.19 25.29,15.51 v25.48,15.32
  Top 0.406: v35.53,21.77 37.67,21.77 L7.1
  Bottom 0.254: v25.48,15.32 25.48,16.74 30.5,21.77 v35.53,21.77
N$62  (via drill 0.3)
  Top 0.406: C21.2 R16.1 42.7,21.37 v42.7,20.4 | R9.1 v32.51,24.51
  Bottom 0.406: v32.51,24.51 38.58,24.51 v42.7,20.4
RINPUT1
  Top 0.254: U2.5 17.19,16.01 15.97,14.79 C63.2
SPK+
  Top 0.61: U1.1 53.13,20.48 R6.2
SPK-
  Top 0.61: U1.3 R7.2
SPK_N
  Top 0.406: C33.2 39.46,21.53 L7.2 C29.1
SPK_P
  Top 0.406: R16.2 41.16,23.08 C33.1 41.11,23.09 L6.2 C30.1
VDD_3V3  (via drill 0.3)
  Top 0.254: 14.78,11.71 C2.2 | 18.57,14.5 U2.8 | U2.10 20.51,13.12 20.09,12.7 | 19.02,14.45 18.57,13.99
  Top 0.406: 20.09,12.7 18.67,12.7 18.09,13.28 18.57,13.76 | 18.57,13.76 18.57,13.99 18.57,14.5 v18.06,15.01 | 18.57,13.76 18.57,13.16 18.97,12.75
  Top 0.61: R2.2 R1.2 | C3.2 X2.1 X2.4 14.75,10.38 14.75,10.85 | 14.75,10.85 C2.2 14.72,11.77 C1.2 18.09,13.28 | v15.49,11.12 15.03,11.12 14.75,10.85 | R38.1 11.55,21.84 v12.17,22.45
  Top 0.813: 30.46,8.46 30.46,8.36 D2.C
  Top 1.016: R1.2 30.46,8.46 v29.54,8.46 | D2.C 31.02,9.83 | 31.02,9.83 31.02,11.95 D5.C 30.94,13.76 R10.1 | R18.2 31.1,9.91 31.02,9.83
  Bottom 0.61: v15.49,11.12 19.28,11.12 21.95,8.46 v29.54,8.46 | v12.17,22.45 16.69,22.45 18.06,21.08 v18.06,15.01
VDD_5V  (via drill 0.3)
  Top 0.254: U2.26 23.01,19.35 23.34,19.68 24.71,19.68 26.34,18.06 26.7,18.06 | 26.7,18.06 28.25,18.06 | 28.25,18.06 30.45,18.06 | 26.7,18.06 26.72,18.04 C12.2 U2.21 | 28.25,18.06 28.33,17.98 C15.2 29.25,16.5 v29.34,16.59 | v37.45,15.82 v37.44,15.82
  Top 0.406: U1.6 U1.5 U1.4 49.32,20.21 C11.2 C14.2 | PI.4 52.83,3.49 52.83,6.68
  Top 0.61: R17.2 49.32,9.32 U1.13 49.32,15.88 | 49.32,15.88 U1.4 | 48.77,15.8 49.25,15.8 49.32,15.88
  Top 0.813: 52.83,6.68 51.94,7.57 C40.1 49.55,7.59 R17.2 C22.2 | v37.45,15.82 39.27,15.82 C8.1 C37.1 C9.1 48.77,15.8
  Top 1.016: PI.4 PI.2 | 30.45,18.06 30.86,18.06 32,19.2 U4.3
  Bottom 0.813: v37.44,15.82 30.1,15.82 v29.34,16.59
  pour Top: 23.9,16.64 25.48,16.64 26.04,17.2 26.04,18.11 26.47,18.54 29.49,18.54 30.78,19.84 31.83,19.84 31.83,18.47 29.54,16.18 26.42,16.18 26.11,16.48 23.9,16.48
  pour Top: 46.91,21.01 46.91,19.25 46.53,18.87 46.53,16.51 46.1,16.08 46.1,15.54 48.31,15.54 49.1,14.76 49.5,14.76 49.5,20.9 49.38,21.03 46.94,21.03
VMID
  Top 0.254: U2.27 22.51,19.79 22.89,20.17 26.67,20.17 26.65,20.14 26.36,20.14 26.64,20.42
  Top 0.406: C4.1 26.67,20.17 C5.1

### Text on the board
tPlace: - | +
bPlace: Voice Interaction Hat for | raspberry pi v1.1 | www.makerfabs.com | GND | GPIO26 | GPIO19 | GPIO13 | GPIO06 | GPIO05 | ID_SD | GND | GPIO11 | GPIO09 | GPIO10 | 3.3V | GPIO22 | GPIO27 | GPIO17 | GND | GPIO04 | GPIO03 | GPIO02 | 3V3 | GPIO21 | GPIO20 | GPIO16 | GND | GPIO12 | GND | ID_SC | GPIO07 | GPIO08 | GPIO25 | GND | GPIO24 | GPIO23 | GND | GPIO18 | GPIO15 | GPIO14 | GND | 5V | 5V